# Altium project OpenRing-V1R1.PrjPcb (part 1 of 2)
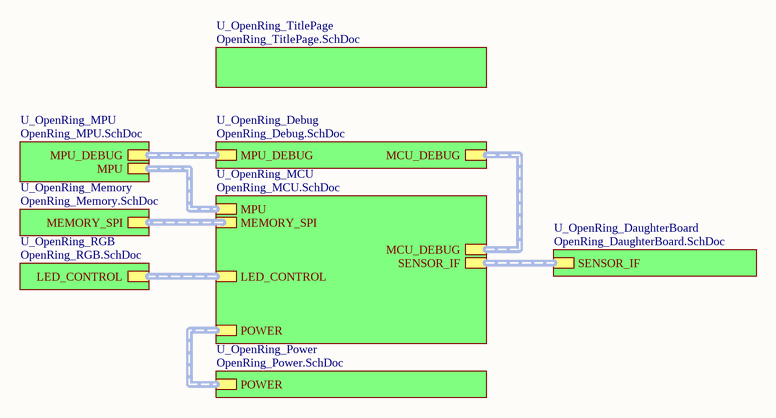
[diagram p0: OpenRing-Main.SchDoc]
ApprovedBy: Dariush Salami; BoardName: ORing-RevA; DrawnBy: Yusein Ali; Engineer: Yusein Ali; Project: OpenRing-V1R0; Revision: A0; RevisionDate: 01.05.2025
9 sheets, 73 parts. Net scope: hierarchical (ports join the sheet entries above them; power ports are global).
Board file: OpenRing-V1R1-MainBoard.PcbDoc
Sheets:
  OpenRing-Main.SchDoc
    U_OpenRing_MCU = OpenRing_MCU.SchDoc
    U_OpenRing_Debug = OpenRing_Debug.SchDoc
    U_OpenRing_MPU = OpenRing_MPU.SchDoc
    U_OpenRing_Memory = OpenRing_Memory.SchDoc
    U_OpenRing_RGB = OpenRing_RGB.SchDoc
    U_OpenRing_DaughterBoard = OpenRing_DaughterBoard.SchDoc
    U_OpenRing_Power = OpenRing_Power.SchDoc
    U_OpenRing_TitlePage = OpenRing_TitlePage.SchDoc

## Sheet OpenRing-Main.SchDoc
size A4; Size: A4; ApprovedBy: Dariush Salami; DrawnBy: Yusein Ali; Engineer: Yusein Ali; Revision: A0; SheetNumber: 1; SheetTotal: 9

### Sub-sheets
U_OpenRing_DaughterBoard = OpenRing_DaughterBoard.SchDoc: SENSOR_IF (harness SENSOR_IF)
U_OpenRing_Debug = OpenRing_Debug.SchDoc: MPU_DEBUG (harness MPU_DEBUG), MCU_DEBUG (harness MCU_DEBUG)
U_OpenRing_MCU = OpenRing_MCU.SchDoc: MEMORY_SPI (harness MEMORY_SPI), MPU (harness MPU), SENSOR_IF (harness SENSOR_IF), POWER (harness POWER), MCU_DEBUG (harness MCU_DEBUG), LED_CONTROL (harness LED_CONTROL)
U_OpenRing_Memory = OpenRing_Memory.SchDoc: MEMORY_SPI (harness MEMORY_SPI)
U_OpenRing_MPU = OpenRing_MPU.SchDoc: MPU (harness MPU), MPU_DEBUG (harness MPU_DEBUG)
U_OpenRing_Power = OpenRing_Power.SchDoc: POWER (harness POWER)
U_OpenRing_RGB = OpenRing_RGB.SchDoc: LED_CONTROL (harness LED_CONTROL)
U_OpenRing_TitlePage = OpenRing_TitlePage.SchDoc: no entries

### Buses and harness runs
harness sheet U_OpenRing_DaughterBoard/SENSOR_IF = sheet U_OpenRing_MCU/SENSOR_IF
harness sheet U_OpenRing_Debug/MCU_DEBUG = sheet U_OpenRing_MCU/MCU_DEBUG
harness sheet U_OpenRing_Debug/MPU_DEBUG = sheet U_OpenRing_MPU/MPU_DEBUG
harness sheet U_OpenRing_MCU/LED_CONTROL = sheet U_OpenRing_RGB/LED_CONTROL
harness sheet U_OpenRing_MCU/MEMORY_SPI = sheet U_OpenRing_Memory/MEMORY_SPI
harness sheet U_OpenRing_MCU/MPU = sheet U_OpenRing_MPU/MPU
harness sheet U_OpenRing_MCU/POWER = sheet U_OpenRing_Power/POWER

### Notes on the sheet
- Designer/Engineer
- Drawn By
- Document Name
- Board Title
- Sheet
- of
- Size
- A4
- Approved By
- Rev.
- Date

## Sheet OpenRing_MCU.SchDoc
size A3; Size: A4; ApprovedBy: Dariush Salami; DrawnBy: Yusein Ali; Engineer: Yusein Ali; Revision: A0; SheetNumber: 2; SheetTotal: 9
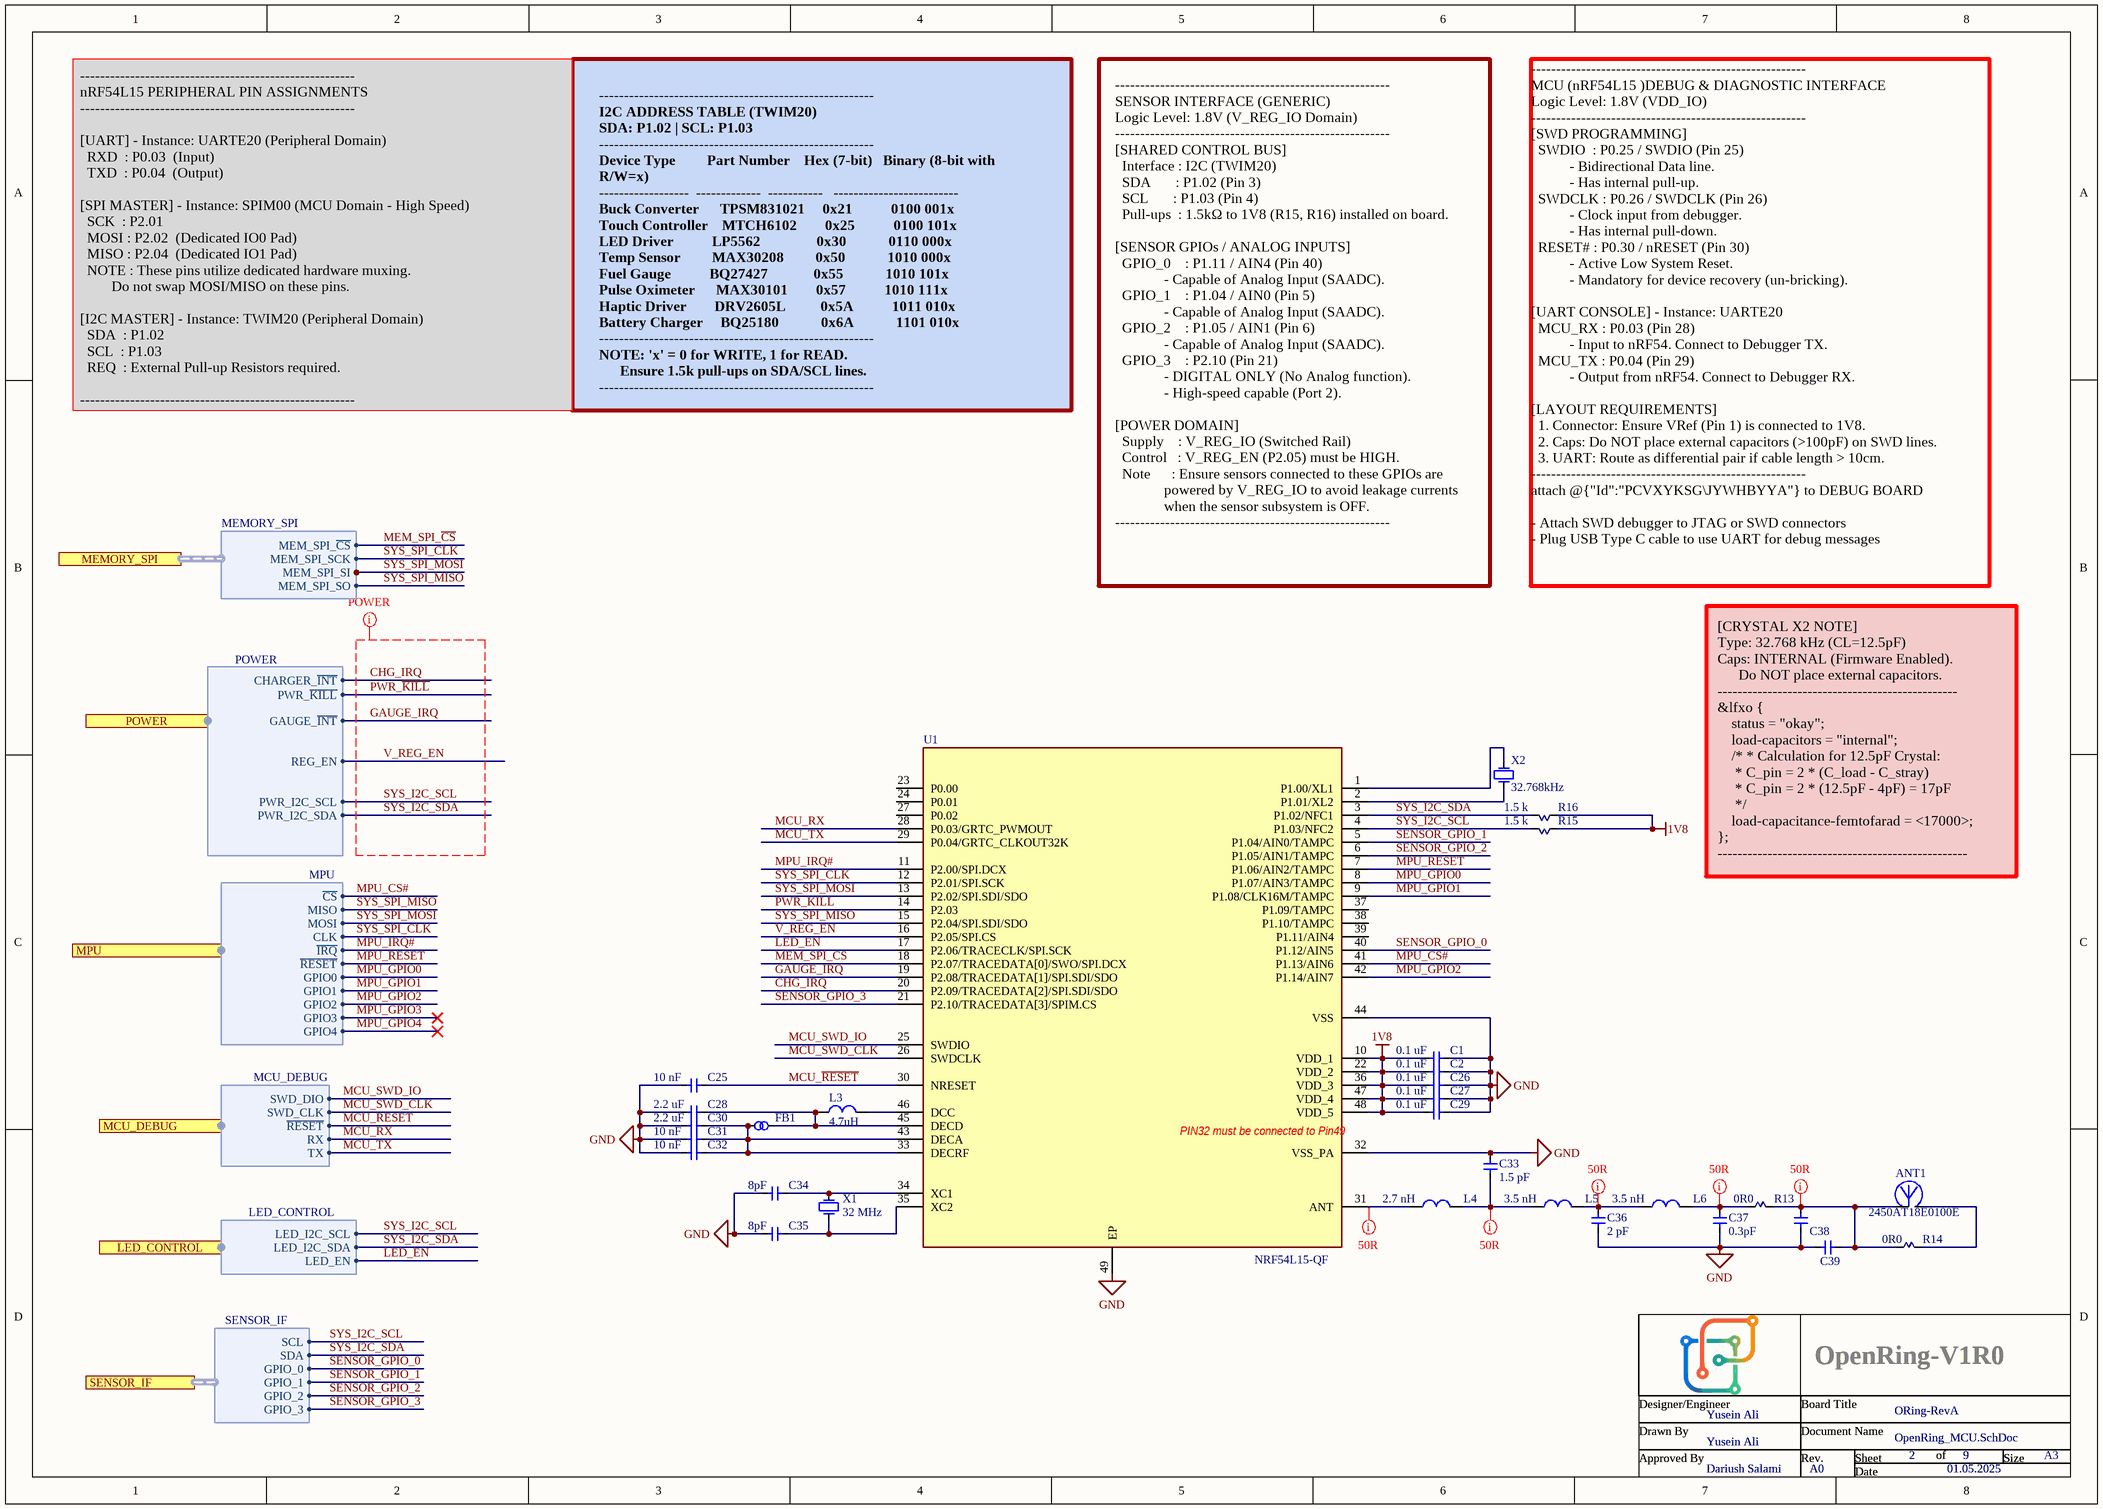
[diagram p1: OpenRing_MCU.SchDoc]

### Parts
ANT1  2450AT18E0100E  [ANTC3216X130N]
C1  0.1 uF  [CAPC1005X05N]
C2  0.1 uF  [CAPC1005X05N]
C25  10 nF  [CAPC1005X05N]
C26  0.1 uF  [CAPC1005X05N]
C27  0.1 uF  [CAPC1005X05N]
C28  2.2 uF  [CAPC1005X05N]
C29  0.1 uF  [CAPC1005X05N]
C30  2.2 uF  [CAPC1005X05N]
C31  10 nF  [CAPC1005X05N]
C32  10 nF  [CAPC1005X05N]
C33  1.5 pF  [CAPC1005X05N]
C34  8pF  [CAPC1005X05N]
C35  8pF  [CAPC1005X05N]
C36  2 pF  [CAPC1005X05N]
C37  0.3pF  [INDC1005X06N]
C38  NC  [CAPC1005X05N]  (value not drawn)
C39  NC  [CAPC1005X05N]  (value not drawn)
FB1  BLM15AG121SN1D  [INDC1005X06N]  (value not drawn)
L3  4.7uH  [INDC1005X06N]
L4  2.7 nH  [INDC1005X06N]
L5  3.5 nH  [INDC1005X06N]
L6  3.5 nH  [INDC1005X06N]
R13  0R0  [RESC1005X04N]
R14  0R0  [RESC1005X04N]
R15  1.5 k  [RESC1005X04N]
R16  1.5 k  [RESC1005X04N]
U1  NRF54L15-QF  [QFN40P600X600X95-49N]
X1  32 MHz  [FP-ABM11W-MFG]
X2  32.768kHz  [Abracon_ABS6_2012X06L]

### Ports
LED_CONTROL (harness LED_CONTROL), MCU_DEBUG (harness MCU_DEBUG), MEMORY_SPI (harness MEMORY_SPI), MPU (harness MPU), POWER (harness POWER), SENSOR_IF (harness SENSOR_IF)

### Harnesses
MEMORY_SPI: MEM_SPI_~{CS}, MEM_SPI_SI, MEM_SPI_SO, MEM_SPI_SCK
MPU: ~{CS}, MISO, MOSI, CLK, ~{IRQ}, ~{RESET}, GPIO0, GPIO1, GPIO2, GPIO3, GPIO4
POWER: CHARGER_~{INT}, PWR_I2C_SCL, PWR_~{KILL}, GAUGE_~{INT}, PWR_I2C_SDA, REG_EN
MCU_DEBUG: SWD_DIO, SWD_CLK, ~{RESET}, RX, TX
SENSOR_IF: SCL, SDA, GPIO_0, GPIO_1, GPIO_2, GPIO_3
LED_CONTROL: LED_I2C_SCL, LED_I2C_SDA, LED_EN

### Nets
1V8: C1.1 C2.1 C26.1 C27.1 C29.1 R15.1 R16.1 U1.10(VDD_1) U1.22(VDD_2) U1.36(VDD_3) U1.47(VDD_4) U1.48(VDD_5)
GND: C1.2 C2.2 C25.1 C26.2 C27.2 C28.1 C29.2 C30.1 C31.1 C32.1 C33.2 C34.1 C35.1 C36.1 C37.1 C38.1 C39.2 U1.32(VSS_PA) U1.44(VSS) U1.49(EP)
CHG_IRQ: U1.20(P2.09/TRACEDATA[2]/SPI.SDI/SDO) ; port POWER.CHARGER_~{INT}
GAUGE_IRQ: U1.19(P2.08/TRACEDATA[1]/SPI.SDI/SDO) ; port POWER.GAUGE_~{INT}
LED_EN: U1.17(P2.06/TRACECLK/SPI.SCK) ; port LED_CONTROL.LED_EN
MCU_~{RESET}: C25.2 U1.30(NRESET) ; port MCU_DEBUG.~{RESET}
MCU_RX: U1.28(P0.03/GRTC_PWMOUT) ; port MCU_DEBUG.RX
MCU_SWD_CLK: U1.26(SWDCLK) ; port MCU_DEBUG.SWD_CLK
MCU_SWD_IO: U1.25(SWDIO) ; port MCU_DEBUG.SWD_DIO
MCU_TX: U1.29(P0.04/GRTC_CLKOUT32K) ; port MCU_DEBUG.TX
MEM_SPI_~{CS}: U1.18(P2.07/TRACEDATA[0]/SWO/SPI.DCX) ; port MEMORY_SPI.MEM_SPI_~{CS}
MPU_CS#: U1.41(P1.13/AIN6) ; port MPU.~{CS}
MPU_GPIO0: U1.8(P1.07/AIN3/TAMPC) ; port MPU.GPIO0
MPU_GPIO1: U1.9(P1.08/CLK16M/TAMPC) ; port MPU.GPIO1
MPU_GPIO2: U1.42(P1.14/AIN7) ; port MPU.GPIO2
MPU_IRQ#: U1.11(P2.00/SPI.DCX) ; port MPU.~{IRQ}
MPU_~{RESET}: U1.7(P1.06/AIN2/TAMPC) ; port MPU.~{RESET}
PWR_~{KILL}: U1.14(P2.03) ; port POWER.PWR_~{KILL}
SENSOR_GPIO_0: U1.40(P1.12/AIN5) ; port SENSOR_IF.GPIO_0
SENSOR_GPIO_1: U1.5(P1.04/AIN0/TAMPC) ; port SENSOR_IF.GPIO_1
SENSOR_GPIO_2: U1.6(P1.05/AIN1/TAMPC) ; port SENSOR_IF.GPIO_2
SENSOR_GPIO_3: U1.21(P2.10/TRACEDATA[3]/SPIM.CS) ; port SENSOR_IF.GPIO_3
SYS_I2C_SCL: R15.2 U1.4(P1.03/NFC2) ; port POWER.PWR_I2C_SCL, port SENSOR_IF.SCL, port LED_CONTROL.LED_I2C_SCL  [project net PWR_I2C_SCL]
SYS_I2C_SDA: R16.2 U1.3(P1.02/NFC1) ; port POWER.PWR_I2C_SDA, port SENSOR_IF.SDA, port LED_CONTROL.LED_I2C_SDA  [project net PWR_I2C_SDA]
SYS_SPI_CLK: U1.12(P2.01/SPI.SCK) ; port MEMORY_SPI.MEM_SPI_SCK, port MPU.CLK  [project net MPU_CLK]
SYS_SPI_MISO: U1.15(P2.04/SPI.SDI/SDO) ; port MEMORY_SPI.MEM_SPI_SO, port MPU.MISO  [project net MPU_MISO]
SYS_SPI_MOSI: U1.13(P2.02/SPI.SDI/SDO) ; port MEMORY_SPI.MEM_SPI_SI, port MPU.MOSI  [project net MPU_MOSI]
V_REG_EN: U1.16(P2.05/SPI.CS) ; port POWER.REG_EN
NetANT1_1: ANT1.1 C38.2 C39.1 R13.2 R14.1
NetANT1_2: ANT1.2 R14.2
NetC28_2: C28.2 FB1.2 L3.1 U1.45(DECD)
NetC30_2: C30.2 C31.2 C32.2 FB1.1 U1.33(DECRF) U1.43(DECA)
NetC33_1: C33.1 L4.2 L5.1
NetC34_2: C34.2 U1.34(XC1) X1.3(OSC2)
NetC35_2: C35.2 U1.35(XC2) X1.1(OSC1)
NetC36_2: C36.2 L5.2 L6.1
NetC37_2: C37.2 L6.2 R13.1
NetL3_2: L3.2 U1.46(DCC)
NetL4_1: L4.1 U1.31(ANT)
NetU1_1: U1.1(P1.00/XL1) X2.2(OSC2)
NetU1_2: U1.2(P1.01/XL2) X2.1(OSC1)

Not connected (* = marked no-connect by the designer): U1 23(P0.00) 24(P0.01) 27(P0.02) 37(P1.09/TAMPC) 38(P1.10/TAMPC) 39(P1.11/AIN4)

### Layout directives
net class PWR Control: CHG_IRQ, GAUGE_IRQ, PWR_~{KILL}, SYS_I2C_SCL, SYS_I2C_SDA, V_REG_EN
Impedance: 50; rule Width Constraint [Pref Impedance = 50.00ohms    Min Impedance = 50.00ohms    Max Impedance = 50.00ohms]: NetANT1_1, NetC33_1, NetC36_2, NetC37_2, NetL4_1

### Notes on the sheet
- -------------------------------------------------------
  nRF54L15 PERIPHERAL PIN ASSIGNMENTS
  -------------------------------------------------------
  [UART] - Instance: UARTE20 (Peripheral Domain)
  RXD  : P0.03  (Input)
  TXD  : P0.04  (Output)
  [SPI MASTER] - Instance: SPIM00 (MCU Domain - High Speed)
  SCK  : P2.01
  MOSI : P2.02  (Dedicated IO0 Pad)
  MISO : P2.04  (Dedicated IO1 Pad)
  NOTE : These pins utilize dedicated hardware muxing.
  Do not swap MOSI/MISO on these pins.
  [I2C MASTER] - Instance: TWIM20 (Peripheral Domain)
  SDA  : P1.02
  SCL  : P1.03
  REQ  : External Pull-up Resistors required.
  -------------------------------------------------------
- -------------------------------------------------------
  I2C ADDRESS TABLE (TWIM20)
  SDA: P1.02 | SCL: P1.03
  -------------------------------------------------------
  Device Type         Part Number    Hex (7-bit)   Binary (8-bit with R/W=x)
  ------------------  -------------  -----------   -------------------------
  Buck Converter      TPSM831021     0x21           0100 001x
  Touch Controller    MTCH6102        0x25           0100 101x
  LED Driver           LP5562                0x30            0110 000x
  Temp Sensor         MAX30208         0x50            1010 000x
  Fuel Gauge           BQ27427             0x55            1010 101x
  Pulse Oximeter      MAX30101        0x57           1010 111x
  Haptic Driver        DRV2605L          0x5A           1011 010x
  Battery Charger     BQ25180            0x6A            1101 010x
  -------------------------------------------------------
  NOTE: 'x' = 0 for WRITE, 1 for READ.
  Ensure 1.5k pull-ups on SDA/SCL lines.
  -------------------------------------------------------
- -------------------------------------------------------
  SENSOR INTERFACE (GENERIC)
  Logic Level: 1.8V (V_REG_IO Domain)
  -------------------------------------------------------
  [SHARED CONTROL BUS]
  Interface : I2C (TWIM20)
  SDA       : P1.02 (Pin 3)
  SCL       : P1.03 (Pin 4)
  Pull-ups  : 1.5kΩ to 1V8 (R15, R16) installed on board.
  [SENSOR GPIOs / ANALOG INPUTS]
  GPIO_0    : P1.11 / AIN4 (Pin 40)
  - Capable of Analog Input (SAADC).
  GPIO_1    : P1.04 / AIN0 (Pin 5)
  - Capable of Analog Input (SAADC).
  GPIO_2    : P1.05 / AIN1 (Pin 6)
  - Capable of Analog Input (SAADC).
  GPIO_3    : P2.10 (Pin 21)
  - DIGITAL ONLY (No Analog function).
  - High-speed capable (Port 2).
  [POWER DOMAIN]
  Supply    : V_REG_IO (Switched Rail)
  Control   : V_REG_EN (P2.05) must be HIGH.
  Note      : Ensure sensors connected to these GPIOs are
  powered by V_REG_IO to avoid leakage currents
  when the sensor subsystem is OFF.
  -------------------------------------------------------
- -------------------------------------------------------
  MCU (nRF54L15 )DEBUG & DIAGNOSTIC INTERFACE
  Logic Level: 1.8V (VDD_IO)
  -------------------------------------------------------
  [SWD PROGRAMMING]
  SWDIO  : P0.25 / SWDIO (Pin 25)
  - Bidirectional Data line.
  - Has internal pull-up.
  SWDCLK : P0.26 / SWDCLK (Pin 26)
  - Clock input from debugger.
  - Has internal pull-down.
  RESET# : P0.30 / nRESET (Pin 30)
  - Active Low System Reset.
  - Mandatory for device recovery (un-bricking).
  [UART CONSOLE] - Instance: UARTE20
  MCU_RX : P0.03 (Pin 28)
  - Input to nRF54. Connect to Debugger TX.
  MCU_TX : P0.04 (Pin 29)
  - Output from nRF54. Connect to Debugger RX.
  [LAYOUT REQUIREMENTS]
  1. Connector: Ensure VRef (Pin 1) is connected to 1V8.
  2. Caps: Do NOT place external capacitors (>100pF) on SWD lines.
  3. UART: Route as differential pair if cable length > 10cm.
  -------------------------------------------------------
  attach @{"Id":"PCVXYKSG\JYWHBYYA"} to DEBUG BOARD
  - Attach SWD debugger to JTAG or SWD connectors
  - Plug USB Type C cable to use UART for debug messages
- [CRYSTAL X2 NOTE]
  Type: 32.768 kHz (CL=12.5pF)
  Caps: INTERNAL (Firmware Enabled).
  Do NOT place external capacitors.
  ------------------------------------------------
  &lfxo {
  status = "okay";
  load-capacitors = "internal";
  /* * Calculation for 12.5pF Crystal:
  * C_pin = 2 * (C_load - C_stray)
  * C_pin = 2 * (12.5pF - 4pF) = 17pF
  */
  load-capacitance-femtofarad = <17000>;
  };
  --------------------------------------------------
- (near U1) PIN32 must be connected to Pin49
- Designer/Engineer
- Drawn By
- Document Name
- Board Title
- Sheet
- of
- Size
- A3
- Approved By
- Rev.
- Date

### Library data of the parts
ANT1 = 2450AT18E0100E: 7 Inch Reel / Mini 2.45Ghz Chip Antenna; Manufacturer: Johanson; Checked: TRUE; Supplier: Mouser; Supplier Part Number: 609-2450AT18E0100E; Manufacturer Part Number: 2450AT18E0100E; RoHS: Yes; Category: RF Antennas; Stock: 4431; Pricing: 1=0.69, 10=0.624, 50=0.624, 100=0.479, 1000=0.303, 10000=0.245 (USD); ComponentLink1URL: https://datasheet.ciiva.com/24048/antenna-2450at18e0100-253355-24048542.pdf?src-supplier=Mouser; ComponentLink1Description: https://datasheet.ciiva.com/24048/antenna-2450at18e0100-253355-24048542.pdf?src-supplier=Mouser; Supplier 1: Mouser; Supplier Part Number 1: 609-2450AT18E0100E
C1 C2 C26 C27 C29 = GRM155R61C104KA88D: CAP CER 0.1UF 16V X5R 0402; Manufacturer: Murata Electronics; Tolerance: 10 %; Type: Chip Multilayer Ceramic Capacitor for General Purpose; Voltage Rating DC: 16 VDC; Capacitance - nF: 100 nF; Capacitance - pF: 100000 pF; Manufacturer Part Number: GRM155R61C104KA88D; RoHS: RoHS Compliant; Category: Multilayer Ceramic Capacitors MLCC - SMD/SMT; Stock: 0; Pricing: 1=0.082, 10=0.026, 100=0.011, 500=0.008, 1000=0.007, 2500=0.006, 5000=0.005, 10000=0.004 (EUR); Capacitance: 0.1 uF; Height: 0.5 mm; Length: 1 mm; Package / Case: 0402 (1005 metric); Packaging: Cut Tape; Product: General Type MLCCs; Series: GRM; Termination Style: SMD/SMT; Width: 0.5 mm; Brand: Murata Electronics; Case Code - in: 0402; Case Code - mm: 1005; Dielectric: X5R; Maximum Operating Temperature: + 85 C; Minimum Operating Temperature: - 55 C; Standard Pack Qty: 10000; Termination: Standard; RoHS - Mouser: Y; Minimum Order Quantity: 1; Reeling: True; ComponentLink1URL: http://www.mouser.com/datasheet/2/281/murata_03052018_GRM_Series_1-1310166.pdf; ComponentLink1Description: http://www.mouser.com/datasheet/2/281/murata_03052018_GRM_Series_1-1310166.pdf; Value: 0.1 uF; Supplier 1: Mouser; Supplier Part Number 1: 81-GRM155R61C104KA8D; Supplier 2: Digikey; Supplier Part Number 2: 490-5415-1-ND; Supplier 3: Digikey; Supplier Part Number 3: 490-5415-6-ND
C25 C31 C32 = GRM155R71H103KA88D: CAP CER 10000PF 50V X7R 0402; Manufacturer: Murata Electronics North America; Tolerance: ±10%; Supplier 1: Digi-Key; Manufacturer Part Number: GRM155R71H103KA88D; RoHS: RoHS Compliant; Category: Capacitors; Stock 1: 7217649; Pricing 1: 1=0.11, 50=0.0056, 100=0.0047, 250=0.00384, 500=0.0033, 1000=0.00256, 5000=0.00213 (GBP); Packaging: Digi-Reel®; Part Status: Active; Capacitance: 10000pF; Voltage - Rated: 50V; Temperature Coefficient: X7R; Mounting Type: Surface Mount, MLCC; Operating Temperature: -55°C ~ 125°C; Applications: General Purpose; Ratings: -; Package / Case: 0402 (1005 Metric); Size / Dimension: 0.039" L x 0.020" W (1.00mm x 0.50mm); Height - Seated (Max): -; Thickness (Max): 0.022" (0.55mm); Lead Spacing: -; Features: -; Lead Style: -; ComponentLink1URL: http://www.murata.com/~/media/webrenewal/support/library/catalog/products/capacitor/mlcc/c02e.pdf; ComponentLink1Description: http://www.murata.com/~/media/webrenewal/support/library/catalog/products/capacitor/mlcc/c02e.pdf; Supplier Part Number 1: 490-4516-6-ND; Value: 10 nF
C28 C30 = GRM155R61A225KE95D: CAP CER 2.2UF 10V X5R 0402; Manufacturer: Murata Electronics North America; Capacitance: 2.2µF; Tolerance: ±10%; Supplier 1: Digi-Key; Manufacturer Part Number: GRM155R61A225KE95D; RoHS: RoHS Compliant; Category: Capacitors; Stock 1: 370562; Pricing 1: 1=0.1, 10=0.06, 50=0.0326, 100=0.0275, 250=0.02252, 500=0.01926, 1000=0.015, 5000=0.0125 (USD); Packaging: Digi-Reel®; Part Status: Active; Voltage - Rated: 10V; Temperature Coefficient: X5R; Operating Temperature: -55°C ~ 85°C; Features: Derating Recommended; Ratings: -; Applications: General Purpose; Mounting Type: Surface Mount, MLCC; Package / Case: 0402 (1005 Metric); Size / Dimension: 0.039" L x 0.020" W (1.00mm x 0.50mm); Height - Seated (Max): -; Thickness (Max): 0.022" (0.55mm); Lead Spacing: -; Lead Style: -; ComponentLink1URL: http://www.murata.com/~/media/webrenewal/support/library/catalog/products/capacitor/mlcc/c02e.ashx; ComponentLink1Description: http://www.murata.com/~/media/webrenewal/support/library/catalog/products/capacitor/mlcc/c02e.ashx; Supplier Part Number 1: 490-10451-6-ND; Value: 2.2 uF
C33 = GJM1555C1H1R5BB01D: Multilayer Ceramic Capacitor, 1.5 pF, 50 V, ï¿½ 0.1pF, C0G (NP0), 0402 [1005 Metric]; Manufacturer: Murata; Material: 4241ConductorMaterial; Supplier: Mouser; Supplier Part Number: 81-GJM1555C1H1R5BB1D; Manufacturer Part Number: GJM1555C1H1R5BB01D; RoHS: Yes; Category: Ceramic Capacitors; Stock: 9670; Pricing: 1=0.1, 10=0.05, 50=0.05, 100=0.03, 1000=0.022, 10000=0.011 (USD); Lead Free: 5697LeadFree; ComponentLink1URL: https://datasheet.ciiva.com/8030/1700191-8030107.pdf?src-supplier=Element14; ComponentLink1Description: https://datasheet.ciiva.com/8030/1700191-8030107.pdf?src-supplier=Element14; ComponentLink2URL: https://datasheet.ciiva.com/26843/getdatasheetpartid-698463-26843693.pdf?src-supplier=Verical; ComponentLink2Description: https://datasheet.ciiva.com/26843/getdatasheetpartid-698463-26843693.pdf?src-supplier=Verical; ComponentLink3URL: https://datasheet.ciiva.com/29542/partnumbering-e-01-29542725.pdf?src-supplier=Digikey; ComponentLink3Description: https://datasheet.ciiva.com/29542/partnumbering-e-01-29542725.pdf?src-supplier=Digikey; ComponentLink4URL: https://datasheet.ciiva.com/29542/partnumbering-e-01-29542726.pdf?src-supplier=Digikey; ComponentLink4Description: https://datasheet.ciiva.com/29542/partnumbering-e-01-29542726.pdf?src-supplier=Digikey; ComponentLink5URL: https://datasheet.ciiva.com/16440/l0005e-16440473.pdf?src-supplier=Future+Electronics; ComponentLink5Description: https://datasheet.ciiva.com/16440/l0005e-16440473.pdf?src-supplier=Future+Electronics; Value: 1.5 pF; Supplier 1: Mouser; Supplier Part Number 1: 81-GJM1555C1H1R5BB1D; Supplier 2: Digikey; Supplier Part Number 2: 490-8087-1-ND; Supplier 3: Digikey; Supplier Part Number 3: 490-8087-6-ND
C34 C35 = GRM1555C1H8R0BA01D: Multilayer Ceramic Capacitors MLCC - SMD/SMT 0402 8.0pF 50volts C0G +/-0.05pF; Manufacturer: Murata; Voltage Rating: 50V; Supplier: Digi-Key; Supplier Part Number: 490-8230-1-ND; Manufacturer Part Number: GRM1555C1H8R0BA01D; RoHS: Yes; Category: Ceramic Capacitors; Stock: 671988; Pricing: 1=0,1, 10=0,051, 50=0,0278, 100=0,0227, 500=0,01624, 1000=0,01276, 2500=0,0116, 5000=0,01067 (USD); Mounting Technology: Surface Mount; Case/Package: 0402; Case Code (Metric): 1005; Case Code (Imperial): 0402; Min Operating Temperature: -55°C; Max Operating Temperature: 125°C; Value: 8pF; Package Quantity: 1; Packaging: Tape and Reel; Series: GRM; Termination: SMD/SMT; Voltage Rating (DC): 50V; Dielectric: C0G; Construction: Flat; Length: 1mm; Width: 0.02inch; Height: 0.5mm; Thickness: 0.022inch; Depth: 0.5mm; Radiation Hardening: No; RoHS Compliant: Yes; Lead Free: Lead Free; ComponentLink1URL: https://datasheet.ciiva.com/18184/getdatasheetpartid-319021-18184500.pdf?src-supplier=Verical; ComponentLink1Description: https://datasheet.ciiva.com/18184/getdatasheetpartid-319021-18184500.pdf?src-supplier=Verical; ComponentLink2URL: https://datasheet.ciiva.com/6263/grm1555c1h820ga01-01-6263780.pdf?src-supplier=Digi-Key; ComponentLink2Description: https://datasheet.ciiva.com/6263/grm1555c1h820ga01-01-6263780.pdf?src-supplier=Digi-Key; ComponentLink3URL: https://datasheet.ciiva.com/5432/product-5432205.pdf?src-supplier=Mouser; ComponentLink3Description: https://datasheet.ciiva.com/5432/product-5432205.pdf?src-supplier=Mouser; ComponentLink4URL: https://datasheet.ciiva.com/11610/product-11610151.pdf?src-supplier=Avnet; ComponentLink4Description: https://datasheet.ciiva.com/11610/product-11610151.pdf?src-supplier=Avnet; ComponentLink5URL: https://datasheet.ciiva.com/16495/c02e-16495287.pdf?src-supplier=Future+Electronics; ComponentLink5Description: https://datasheet.ciiva.com/16495/c02e-16495287.pdf?src-supplier=Future+Electronics; ComponentLink6URL: https://datasheet.ciiva.com/5442/product-5442458.pdf?src-supplier=Mouser; ComponentLink6Description: https://datasheet.ciiva.com/5442/product-5442458.pdf?src-supplier=Mouser; Supplier 1: Mouser; Supplier Part Number 1: 81-GRM1555C1H8R0BA1D; Supplier 2: Digikey; Supplier Part Number 2: 490-8230-1-ND; Supplier 3: Digikey; Supplier Part Number 3: 490-8230-6-ND
C36 = GJM1555C1H2R0WB01D: 0402 2 pF 50V ±0.05 pF Tolerance C0G SMT Multilayer Ceramic Capacitor; Manufacturer: Murata; Material: 4241ConductorMaterial; Temperature Coefficient: 30ppm/°C; Supplier: Mouser; Supplier Part Number: 81-GJM1555C1H2R0WB1D; Manufacturer Part Number: GJM1555C1H2R0WB01D; RoHS: Yes; Category: Ceramic Capacitors; Stock: 97187; Pricing: 1=0.14, 10=0.077, 50=0.077, 100=0.047, 1000=0.032, 10000=0.019 (USD); Lead Free: 5697LeadFree; ComponentLink1URL: https://datasheet.ciiva.com/26843/getdatasheetpartid-724043-26843695.pdf?src-supplier=Verical; ComponentLink1Description: https://datasheet.ciiva.com/26843/getdatasheetpartid-724043-26843695.pdf?src-supplier=Verical; Supplier 1: Mouser; Supplier Part Number 1: 81-GJM1555C1H2R0WB1D; Supplier 2: Digikey; Supplier Part Number 2: 490-11205-1-ND; Supplier 3: Digikey; Supplier Part Number 3: 490-11205-6-ND; Value: 2 pF
C37 = GJM1555C1HR30WB01D: 0402 0.3 pF 50V ±0.05 pF Tolerance C0G SMT Multilayer Ceramic Capacitor; Manufacturer: Murata; Material: 4241ConductorMaterial; Temperature Coefficient: 30ppm/°C; Supplier: Mouser; Supplier Part Number: 81-GJM1555C1HR30WB1D; Manufacturer Part Number: GJM1555C1HR30WB01D; RoHS: Yes; Category: Ceramic Capacitors; Stock: 24305; Pricing: 1=0.14, 10=0.077, 50=0.077, 100=0.047, 1000=0.031, 10000=0.021 (USD); Mounting Technology: Surface Mount; Case/Package: 0402; Case Code (Metric): 1005; Case Code (Imperial): 0402; Min Operating Temperature: -55°C; Max Operating Temperature: 125°C; Value: 0.3pF; Dielectric: C0G; Voltage Rating (DC): 50V; Packaging: Tape and Reel; Package Quantity: 10000; Termination: SMD/SMT; Series: GJM; Construction: Flat; Voltage Rating: 50V; Length: 1mm; Width: 0.02inch; Height: 0.5mm; Thickness: 0.022inch; Depth: 0.5mm; Radiation Hardening: No; RoHS Compliant: Yes; Lead Free: Lead Free; ComponentLink1URL: https://datasheet.ciiva.com/11617/product-11617574.pdf?src-supplier=Avnet; ComponentLink1Description: https://datasheet.ciiva.com/11617/product-11617574.pdf?src-supplier=Avnet; ComponentLink2URL: https://datasheet.ciiva.com/169/partnumbering-e-01-169995.pdf?src-supplier=Digikey; ComponentLink2Description: https://datasheet.ciiva.com/169/partnumbering-e-01-169995.pdf?src-supplier=Digikey; Supplier 1: Mouser; Supplier Part Number 1: 81-GJM1555C1HR30WB1D; Supplier 2: Digikey; Supplier Part Number 2: 490-11248-1-ND; Supplier 3: Digikey; Supplier Part Number 3: 490-11248-6-ND
C38 C39 = CAPACITOR
FB1 = BLM15AG121SN1D: Ferrite Beads Multi-Layer 120Ohm 25% 100MHz 550mA 190mOhm DCR 0402 Paper T/R; Manufacturer: Murata; Manufacturer Series: BLM15A; Material: Steel,Ferrite; Number of Lines: 1; ESR: 190mR; Impedance: 120R; Max DC Current: 500mA; DC Resistance-Max: 250mR; Shielding: Unshielded; Supplier: Mouser; Supplier Part Number: 81-BLM15AG121SN1D; Manufacturer Part Number: BLM15AG121SN1D; RoHS: Yes; Category: Ferrite Beads and Chips; Stock: 120691; Pricing: 1=0.1, 10=0.043, 50=0.034, 100=0.031, 1000=0.021, 10000=0.013 (USD); Case/Package: 0402; Pins: 2; Case Code (Metric): 1005; Case Code (Imperial): 0402; Core Material: Ferrite; Terminal Finish: Tin; Min Operating Temperature: -55°C; Max Operating Temperature: 125°C; Packaging: Tape and Reel; Max Current Rating: 550mA; Series: BLM15AG_SN; Tolerance: 25%; Test Frequency: 100MHz; RMS Current (Irms): 550mA; Package Quantity: 1; Termination: SMD/SMT; Number of Circuits: 1; Current Rating: 550mA; DC Resistance (DCR): 190mR; Frequency: 100MHz; DC Current: 500mA; Channels: 1; Length: 1mm; Width: 0.5mm; Height: 0.5mm; Depth: 0.55mm; Radiation Hardening: No; RoHS Compliant: Yes; Reach SVHC Compliant: No; Lead Free: Lead Free; Military Standard: Not; Supplier 1: Mouser; Supplier Part Number 1: 81-BLM15AG121SN1D; Supplier 2: Digikey; Supplier Part Number 2: 490-1005-1-ND; Supplier 3: Digikey; Supplier Part Number 3: 490-1005-6-ND
L3 = LQM18FN4R7M00D: Inductor Power Chip Shielded Multi-Layer 4.7uH 20% 1MHz Ferrite 0.08A 0.78Ohm DCR 0603 T/R; Manufacturer: Murata; Self Resonant Frequency: 50MHz; DC Resistance (DCR): 600mR; Current Rating: 80mA; Supplier: Mouser; Supplier Part Number: 81-LQM18FN4R7M00D; Manufacturer Part Number: LQM18FN4R7M00D; RoHS: Yes; Category: Fixed Inductors; Stock: 677; Pricing: 1=0.13, 10=0.11, 50=0.11, 100=0.091, 1000=0.075, 10000=0.06 (USD); Mounting Technology: Surface Mount; Case/Package: 0603; Core Material: Ferrite; Case Code (Metric): 1608; Case Code (Imperial): 0603; Weight: 7.1E-05oz; Min Operating Temperature: -55°C; Max Operating Temperature: 125°C; Tolerance: 20%; Shielding: Shielded; Packaging: Tape and Reel; Value: 4.7uH; Test Frequency: 1MHz; Series: LQM18F; Package Quantity: 1; Saturation Current: 80mA; Max DC Current: 80mA; Termination: SMD/SMT; DC Current: 80mA; Max Current Rating: 80mA; Length: 1.6mm; Width: 0.031inch; Height: 0.8mm; Height - Seated (Max): 0.035inch; Depth: 0.9mm; RoHS Compliant: Yes; Military Standard: Not; Lead Free: Lead Free; ComponentLink1URL: https://datasheet.ciiva.com/30489/0900766b812560c4-30489024.pdf?src-supplier=Rs; ComponentLink1Description: https://datasheet.ciiva.com/30489/0900766b812560c4-30489024.pdf?src-supplier=Rs; ComponentLink2URL: https://datasheet.ciiva.com/1039/l0075s0097lqm18f-1039394.pdf?src-supplier=Digikey; ComponentLink2Description: https://datasheet.ciiva.com/1039/l0075s0097lqm18f-1039394.pdf?src-supplier=Digikey; ComponentLink3URL: https://datasheet.ciiva.com/1039/l0075s0097lqm18f-1039393.pdf?src-supplier=Digikey; ComponentLink3Description: https://datasheet.ciiva.com/1039/l0075s0097lqm18f-1039393.pdf?src-supplier=Digikey; ComponentLink4URL: https://datasheet.ciiva.com/1039/l0075s0097lqm18f-1039395.pdf?src-supplier=Digikey; ComponentLink4Description: https://datasheet.ciiva.com/1039/l0075s0097lqm18f-1039395.pdf?src-supplier=Digikey; ComponentLink5URL: https://datasheet.ciiva.com/3082/l0075s0097lqm18f-3082197.pdf?src-supplier=Avnet; ComponentLink5Description: https://datasheet.ciiva.com/3082/l0075s0097lqm18f-3082197.pdf?src-supplier=Avnet; ComponentLink6URL: https://datasheet.ciiva.com/16390/l0075s0097lqm18f-16390346.pdf?src-supplier=Future+Electronics; ComponentLink6Description: https://datasheet.ciiva.com/16390/l0075s0097lqm18f-16390346.pdf?src-supplier=Future+Electronics; Supplier 1: Mouser; Supplier Part Number 1: 81-LQM18FN4R7M00D; Supplier 2: Digikey; Supplier Part Number 2: 490-4024-1-ND; Supplier 3: Digikey; Supplier Part Number 3: 490-4024-6-ND
L4 = LQG15WH2N7B02D: Inductor Chip 2.7nH 0.1nH Tolerance 2-Pin 0402 Paper T/R; Manufacturer: Murata; Supplier: Mouser; Supplier Part Number: 81-LQG15WH2N7B02D; Manufacturer Part Number: LQG15WH2N7B02D; RoHS: Yes; Category: Fixed Inductors; Stock: 6000; Pricing: 1=0.2, 10=0.161, 50=0.141, 100=0.133, 1000=0.109, 10000=0.088 (USD); Value: 2.7 nH; Supplier 1: Mouser; Supplier Part Number 1: 81-LQG15WH2N7B02D; Supplier 2: Digikey; Supplier Part Number 2: 490-LQG15WH2N7B02DDKR-ND; Supplier 3: Digikey; Supplier Part Number 3: 490-LQG15WH2N7B02DCT-ND
L5 L6 = LQG15WH3N5B02D: Inductor Chip 3.5nH 0.1nH Tolerance 2-Pin 0402 Paper T/R; Manufacturer: Murata; Supplier: Mouser; Supplier Part Number: 81-LQG15WH3N5B02D; Manufacturer Part Number: LQG15WH3N5B02D; RoHS: Yes; Category: Fixed Inductors; Stock: 9594; Pricing: 1=0.24, 10=0.187, 50=0.187, 100=0.146, 1000=0.113, 10000=0.09 (USD); Supplier 1: Mouser; Supplier Part Number 1: 81-LQG15WH3N5B02D; Supplier 2: Farnell; Supplier Part Number 2: 3639288; Supplier 3: Farnell; Supplier Part Number 3: 3639288RL; Value: 3.5 nH
R13 R14 = ERJ-2GE0R00X: RES SMD 0.0OHM JUMPER 1/10W 0402; Manufacturer: Panasonic Electronic Components; Resistance (Ohms): 0.0; Power (Watts): 0.1W, 1/10W; Supplier 1: Digi-Key; Manufacturer Part Number: ERJ-2GE0R00X; RoHS: RoHS Compliant; Category: Resistors; Stock 1: 6022701; Pricing 1: 1=0.07, 50=0.0104, 100=0.0078, 250=0.00584, 500=0.0043, 1000=0.00287, 5000=0.00202 (GBP); Packaging: Digi-Reel®; Part Status: Active; Tolerance: Jumper; Composition: Thick Film; Features: Automotive AEC-Q200; Temperature Coefficient: -; Operating Temperature: -55°C ~ 155°C; Package / Case: 0402 (1005 Metric); Supplier Device Package: 0402; Size / Dimension: 0.039" L x 0.020" W (1.00mm x 0.50mm); Height: 0.016" (0.40mm); Number of Terminations: 2; ComponentLink1URL: http://industrial.panasonic.com/www-cgi/jvcr13pz.cgi?E+PZ+3+AOA0001+ERJ2GE0R00X+7+WW; ComponentLink1Description: http://industrial.panasonic.com/www-cgi/jvcr13pz.cgi?E+PZ+3+AOA0001+ERJ2GE0R00X+7+WW; Supplier Part Number 1: P0.0JDKR-ND; Value: 0R0
R15 R16 = ERJ-2RKF1501X: RES SMD 1.5K OHM 1% 1/10W 0402; Manufacturer: Panasonic Electronic Components; Power (Watts): 0.1W, 1/10W; Temperature Coefficient: ±100ppm/°C; Supplier 1: Digi-Key; Manufacturer Part Number: ERJ-2RKF1501X; RoHS: RoHS Compliant; Category: Resistors; Stock 1: 1349197; Pricing 1: 1=0.1, 10=0.025, 25=0.018, 50=0.0136, 100=0.01, 250=0.00764, 500=0.00612, 1000=0.00451, 5000=0.00323 (USD); Packaging: Digi-Reel®; Part Status: Active; Resistance (Ohms): 1.5k; Tolerance: ±1%; Composition: Thick Film; Features: Automotive AEC-Q200; Operating Temperature: -55°C ~ 155°C; Package / Case: 0402 (1005 Metric); Supplier Device Package: 0402; Size / Dimension: 0.039" L x 0.020" W (1.00mm x 0.50mm); Height - Seated (Max): 0.016" (0.40mm); Number of Terminations: 2; Failure Rate: -; ComponentLink1URL: https://industrial.panasonic.com/cdbs/www-data/pdf/RDA0000/AOA0000C283.pdf; ComponentLink1Description: https://industrial.panasonic.com/cdbs/www-data/pdf/RDA0000/AOA0000C283.pdf; Supplier Part Number 1: P1.50KLDKR-ND; Value: 1.5 k
U1 = NRF54L15-QFAA-R: nRF54L15 SoC with Arm Cortex-M33 processor; Manufacturer: Nordic Semiconductor; Supplier: Mouser; Supplier Part Number: 949-NRF54L15-QFAA-R; Manufacturer Part Number: NRF54L15-QFAA-R; RoHS: No; Category: RF Receivers, Transceivers; Stock: 719; Pricing: 1=6.84, 10=6.11, 50=6.11, 100=5.02, 1000=3.62, 10000=3.07 (USD)
X1 = ABM11W-32.0000MHZ-8-B1U-T3: CRYSTAL 32.0000MHZ 8PF SMD, 2x1.6mm, RoHS; Manufacturer: Abracon; Checked: TRUE; Manufacturer Part Number: ABM11W-32.0000MHZ-8-B1U-T3; RoHS: Yes; Category: Crystals; Frequency: 32 MHz; ComponentLink1URL: https://abracon.com/Resonators/ABM11W.pdf?src-supplier=Digikey; ComponentLink1Description: https://abracon.com/Resonators/ABM11W.pdf?src-supplier=Digikey; Supplier 1: Mouser; Supplier Part Number 1: 815-11W32-8B1UT; Supplier 2: Digikey; Supplier Part Number 2: 535-13899-1-ND; Supplier 3: Digikey; Supplier Part Number 3: 535-13899-6-ND; Supplier 4: Digikey; Supplier Part Number 4: 535-13899-2-ND; Supplier: Digikey; Supplier Part Number: 535-13899-1-ND; Stock: 52771; Pricing: 1=0.82, 10=0.709, 50=0.6394, 100=0.6115, 500=0.5517, 1000=0.52788 (USD); ComponentLink2URL: https://datasheet.octopart.com/ABM11W-32.0000MHZ-8-B1U-T3-Abracon-datasheet-112015802.pdf?src-supplier=Master+Electronics; ComponentLink2Description: https://datasheet.octopart.com/ABM11W-32.0000MHZ-8-B1U-T3-Abracon-datasheet-112015802.pdf?src-supplier=Master+Electronics
X2 = ABS06-32.768KHZ-1-T: CRYSTAL 32.768 KHZ 12.5 PF SMD; Manufacturer: Abracon Corporation; Frequency Tolerance: ±10ppm; Load Capacitance: 12.5pF; ESR (Equivalent Series Resistance): 90 kOhm; Operating Mode: Fundamental; Supplier 1: Digi-Key; Manufacturer Part Number: ABS06-32.768KHZ-1-T; RoHS: RoHS Compliant; Category: Crystals and Oscillators; Stock 1: 6467; Pricing 1: 1=2.25, 10=1.952, 50=1.711, 100=1.3508, 500=1.14066, 750=0.99659, 1000=0.90053 (EUR); Packaging: Digi-Reel®; Type: kHz Crystal (Tuning Fork); Frequency: 32.768kHz; Frequency Stability: -; Operating Temperature: -40°C ~ 85°C; Ratings: -; Mounting Type: Surface Mount; Package / Case: 2-SMD; Size / Dimension: 0.079" L x 0.047" W (2.00mm x 1.20mm); Height: 0.024" (0.60mm); ComponentLink1URL: http://www.abracon.com/Resonators/ABS06.pdf; ComponentLink1Description: http://www.abracon.com/Resonators/ABS06.pdf; Supplier Part Number 1: 535-10248-6-ND

## Sheet OpenRing_Debug.SchDoc
size A4; Size: A4; ApprovedBy: Dariush Salami; DrawnBy: Yusein Ali; Engineer: Yusein Ali; Revision: A0; SheetNumber: 7; SheetTotal: 9
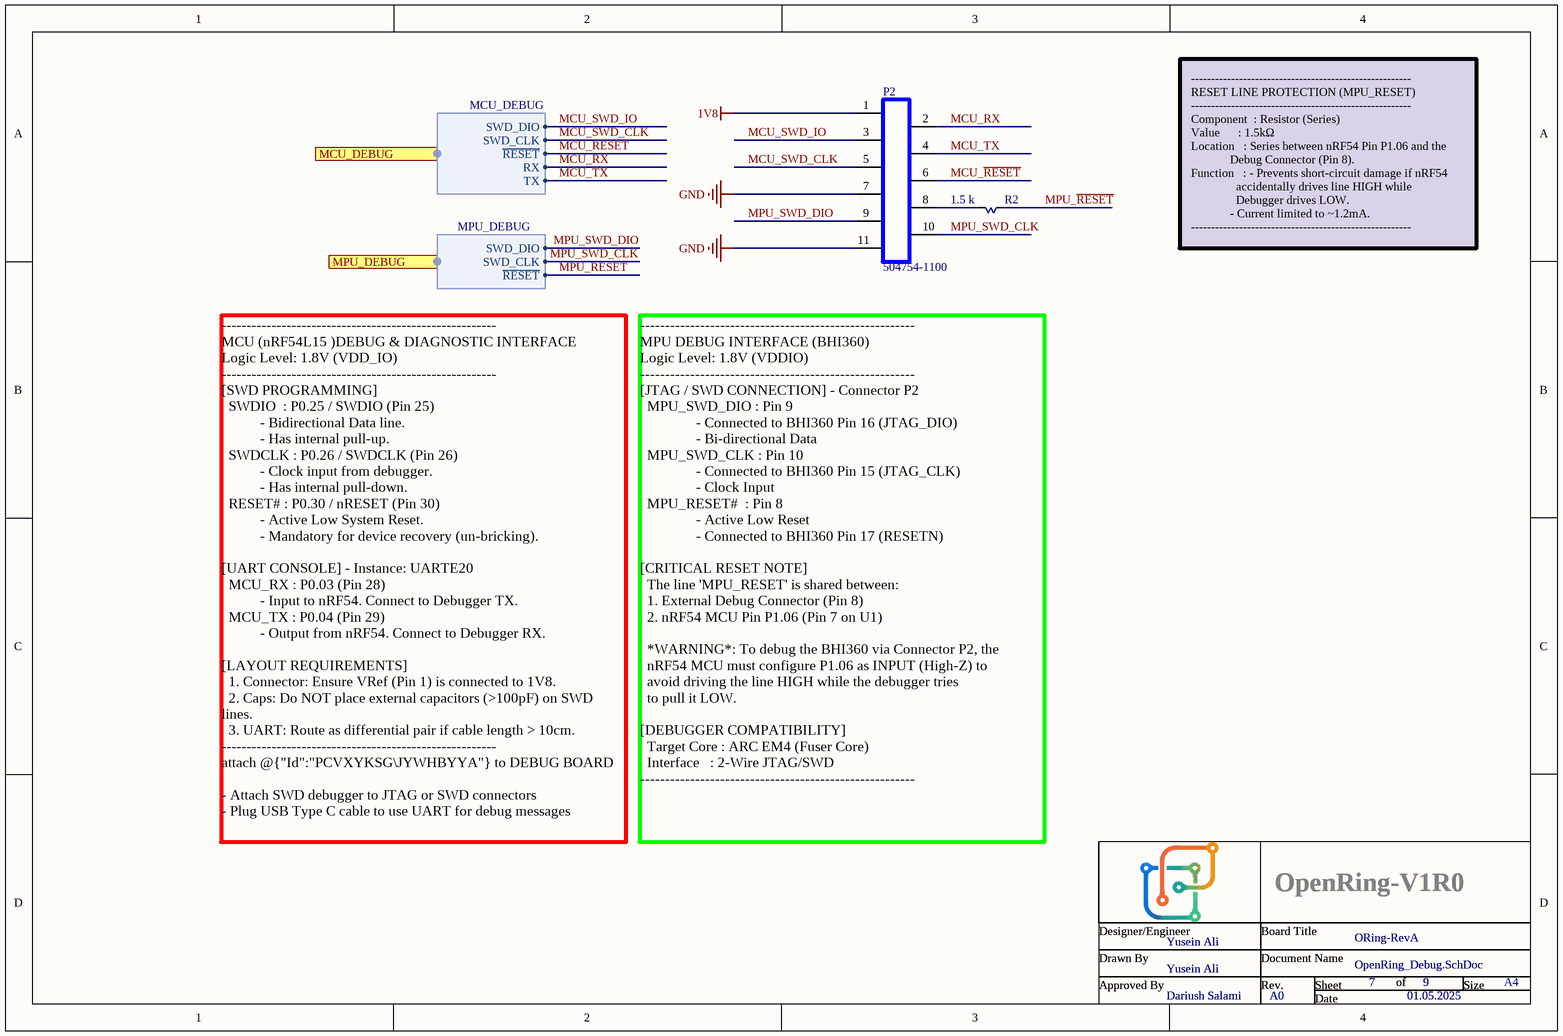
[diagram p2: OpenRing_Debug.SchDoc]

### Parts
P2  504754-1100  [5047541100]
R2  1.5 k  [RESC1005X04N]

### Ports
MCU_DEBUG (harness MCU_DEBUG), MPU_DEBUG (harness MPU_DEBUG)

### Harnesses
MPU_DEBUG: SWD_DIO, SWD_CLK, ~{RESET}
MCU_DEBUG: SWD_DIO, SWD_CLK, ~{RESET}, RX, TX

### Nets
1V8: P2.1
GND: P2.7 P2.11
MCU_~{RESET}: P2.6 ; port MCU_DEBUG.~{RESET}
MCU_RX: P2.2 ; port MCU_DEBUG.RX
MCU_SWD_CLK: P2.5 ; port MCU_DEBUG.SWD_CLK
MCU_SWD_IO: P2.3 ; port MCU_DEBUG.SWD_DIO
MCU_TX: P2.4 ; port MCU_DEBUG.TX
MPU_~{RESET}: R2.1 ; port MPU_DEBUG.~{RESET}
MPU_SWD_CLK: P2.10 ; port MPU_DEBUG.SWD_CLK
MPU_SWD_DIO: P2.9 ; port MPU_DEBUG.SWD_DIO
NetP2_8: P2.8 R2.2

### Notes on the sheet
- -------------------------------------------------------
  RESET LINE PROTECTION (MPU_RESET)
  -------------------------------------------------------
  Component  : Resistor (Series)
  Value      : 1.5kΩ
  Location   : Series between nRF54 Pin P1.06 and the
  Debug Connector (Pin 8).
  Function   : - Prevents short-circuit damage if nRF54
  accidentally drives line HIGH while
  Debugger drives LOW.
  - Current limited to ~1.2mA.
  -------------------------------------------------------
- -------------------------------------------------------
  MCU (nRF54L15 )DEBUG & DIAGNOSTIC INTERFACE
  Logic Level: 1.8V (VDD_IO)
  -------------------------------------------------------
  [SWD PROGRAMMING]
  SWDIO  : P0.25 / SWDIO (Pin 25)
  - Bidirectional Data line.
  - Has internal pull-up.
  SWDCLK : P0.26 / SWDCLK (Pin 26)
  - Clock input from debugger.
  - Has internal pull-down.
  RESET# : P0.30 / nRESET (Pin 30)
  - Active Low System Reset.
  - Mandatory for device recovery (un-bricking).
  [UART CONSOLE] - Instance: UARTE20
  MCU_RX : P0.03 (Pin 28)
  - Input to nRF54. Connect to Debugger TX.
  MCU_TX : P0.04 (Pin 29)
  - Output from nRF54. Connect to Debugger RX.
  [LAYOUT REQUIREMENTS]
  1. Connector: Ensure VRef (Pin 1) is connected to 1V8.
  2. Caps: Do NOT place external capacitors (>100pF) on SWD lines.
  3. UART: Route as differential pair if cable length > 10cm.
  -------------------------------------------------------
  attach @{"Id":"PCVXYKSG\JYWHBYYA"} to DEBUG BOARD
  - Attach SWD debugger to JTAG or SWD connectors
  - Plug USB Type C cable to use UART for debug messages
- -------------------------------------------------------
  MPU DEBUG INTERFACE (BHI360)
  Logic Level: 1.8V (VDDIO)
  -------------------------------------------------------
  [JTAG / SWD CONNECTION] - Connector P2
  MPU_SWD_DIO : Pin 9
  - Connected to BHI360 Pin 16 (JTAG_DIO)
  - Bi-directional Data
  MPU_SWD_CLK : Pin 10
  - Connected to BHI360 Pin 15 (JTAG_CLK)
  - Clock Input
  MPU_RESET#  : Pin 8
  - Active Low Reset
  - Connected to BHI360 Pin 17 (RESETN)
  [CRITICAL RESET NOTE]
  The line 'MPU_RESET' is shared between:
  1. External Debug Connector (Pin 8)
  2. nRF54 MCU Pin P1.06 (Pin 7 on U1)
  *WARNING*: To debug the BHI360 via Connector P2, the
  nRF54 MCU must configure P1.06 as INPUT (High-Z) to
  avoid driving the line HIGH while the debugger tries
  to pull it LOW.
  [DEBUGGER COMPATIBILITY]
  Target Core : ARC EM4 (Fuser Core)
  Interface   : 2-Wire JTAG/SWD
  -------------------------------------------------------
- Designer/Engineer
- Drawn By
- Document Name
- Board Title
- Sheet
- of
- Size
- A4
- Approved By
- Rev.
- Date

### Library data of the parts
P2 = 504754-1100: Conn FFC/FPC Connector SKT 11 POS 0.3mm Solder RA SMD Easy-On™ T/R; Manufacturer: Molex; CHECKED: FALSE; Supplier: Mouser; Supplier Part Number: 538-504754-1100; Manufacturer Part Number: 504754-1100; RoHS: No; Stock: 6459; Pricing: 1=0.77, 10=0.628, 50=0.544, 100=0.512, 1000=0.426, 10000=0.355 (USD); ComponentLink1URL: https://datasheet.octopart.com/504754-1100-Molex-datasheet-169278456.pdf?src-supplier=Farnell; ComponentLink1Description: https://datasheet.octopart.com/504754-1100-Molex-datasheet-169278456.pdf?src-supplier=Farnell; ComponentLink2URL: http://datasheet.octopart.com/5047541100-Molex-datasheet-38188796.pdf?src-supplier=Onlinecomponents.com; ComponentLink2Description: http://datasheet.octopart.com/5047541100-Molex-datasheet-38188796.pdf?src-supplier=Onlinecomponents.com; ComponentLink3URL: http://datasheet.octopart.com/5047541100-Molex-datasheet-38188796.pdf?src-supplier=Verical; ComponentLink3Description: http://datasheet.octopart.com/5047541100-Molex-datasheet-38188796.pdf?src-supplier=Verical; ComponentLink4URL: http://datasheet.octopart.com/5047541100-Molex-datasheet-38188796.pdf?src-supplier=Avnet; ComponentLink4Description: http://datasheet.octopart.com/5047541100-Molex-datasheet-38188796.pdf?src-supplier=Avnet; ComponentLink5URL: http://datasheet.octopart.com/5047541100-Molex-datasheet-38188796.pdf?src-supplier=TTI; ComponentLink5Description: http://datasheet.octopart.com/5047541100-Molex-datasheet-38188796.pdf?src-supplier=TTI; ComponentLink6URL: http://datasheet.octopart.com/5047541100-Molex-datasheet-38188796.pdf?src-supplier=Electro+Sonic; ComponentLink6Description: http://datasheet.octopart.com/5047541100-Molex-datasheet-38188796.pdf?src-supplier=Electro+Sonic; ComponentLink7URL: https://datasheet.octopart.com/504754-1100-Molex-datasheet-154754160.pdf?src-supplier=Master+Electronics; ComponentLink7Description: https://datasheet.octopart.com/504754-1100-Molex-datasheet-154754160.pdf?src-supplier=Master+Electronics; Supplier 1: Mouser; Supplier Part Number 1: 538-504754-1100
R2 = ERJ-2RKF1501X: as R15 on sheet OpenRing_MCU; Supplier 1: Digi-Key; Manufacturer Part Number: ERJ-2RKF1501X; RoHS: RoHS Compliant; Category: Resistors; Stock 1: 1349197; Pricing 1: 1=0.1, 10=0.025, 25=0.018, 50=0.0136, 100=0.01, 250=0.00764, 500=0.00612, 1000=0.00451, 5000=0.00323 (USD); Packaging: Digi-Reel®; Part Status: Active; Resistance (Ohms): 1.5k; Tolerance: ±1%; Composition: Thick Film; Features: Automotive AEC-Q200; Operating Temperature: -55°C ~ 155°C; Package / Case: 0402 (1005 Metric); Supplier Device Package: 0402; Size / Dimension: 0.039" L x 0.020" W (1.00mm x 0.50mm); Height - Seated (Max): 0.016" (0.40mm); Number of Terminations: 2; Failure Rate: -; ComponentLink1URL: https://industrial.panasonic.com/cdbs/www-data/pdf/RDA0000/AOA0000C283.pdf; ComponentLink1Description: https://industrial.panasonic.com/cdbs/www-data/pdf/RDA0000/AOA0000C283.pdf; Supplier Part Number 1: P1.50KLDKR-ND; Value: 1.5 k

## Sheet OpenRing_MPU.SchDoc
size A4; Size: A4; ApprovedBy: Dariush Salami; DrawnBy: Yusein Ali; Engineer: Yusein Ali; Revision: A0; SheetNumber: 5; SheetTotal: 9
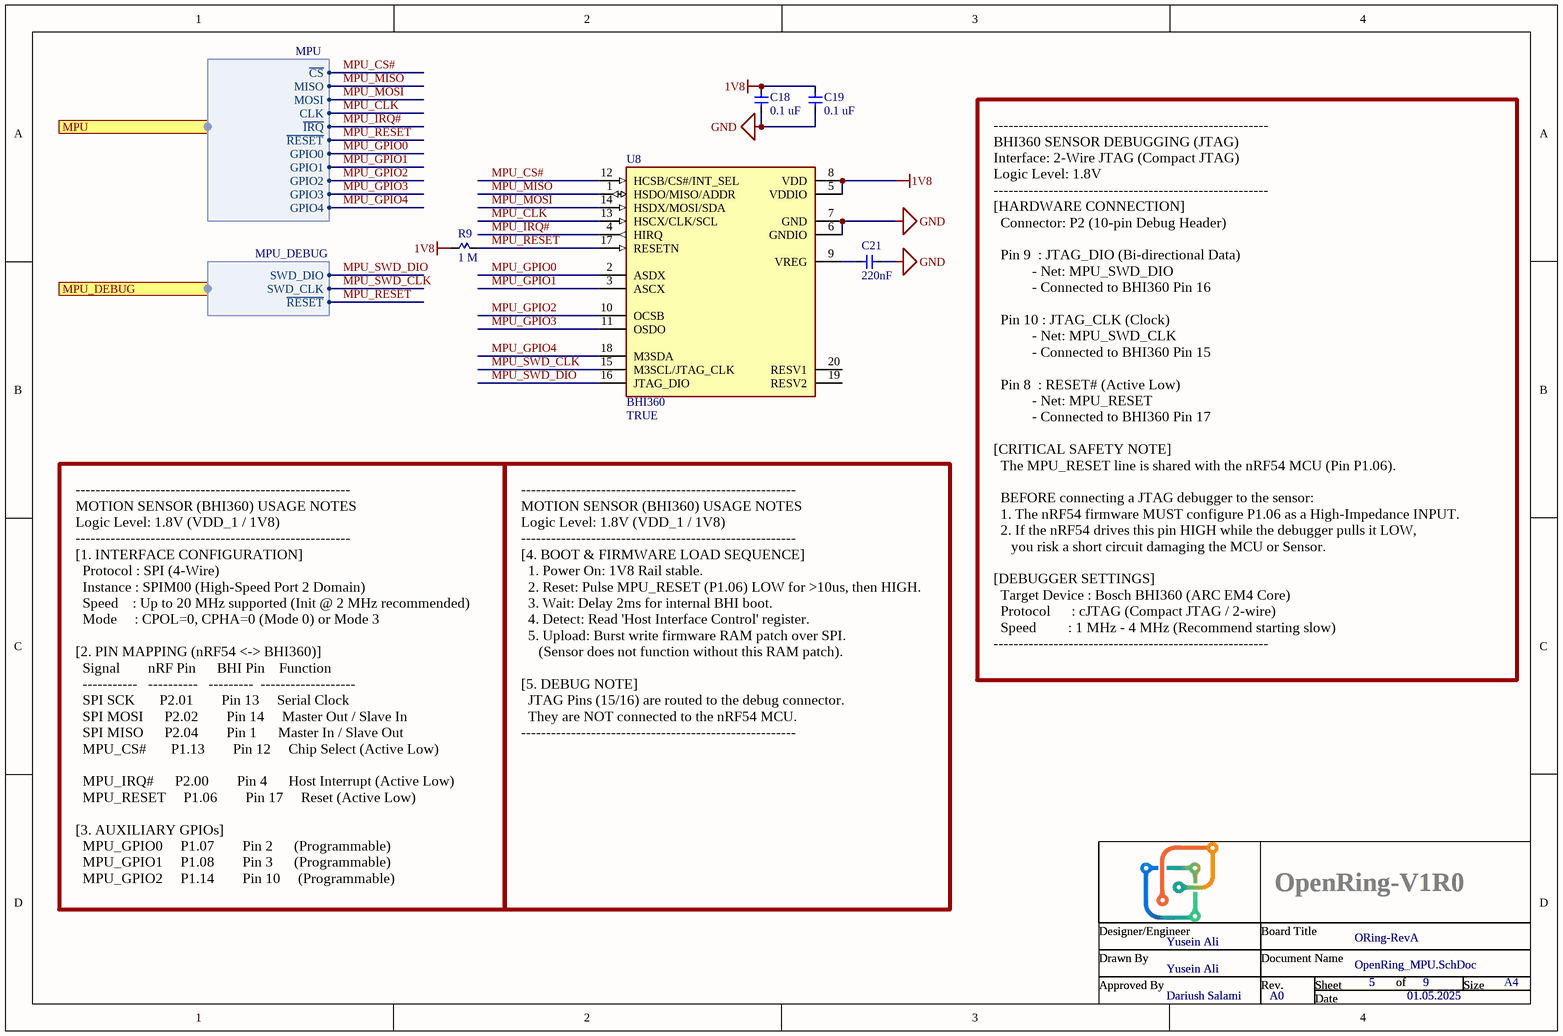
[diagram p3: OpenRing_MPU.SchDoc]

### Parts
C18  0.1 uF  [CAPC1005X05N]
C19  0.1 uF  [CAPC1005X05N]
C21  220nF  [CAPC1005X05N]
R9  1 M  [RESC1005X04N]
U8  BHI360  Checked: TRUE  [BHI360]

### Ports
MPU (harness MPU), MPU_DEBUG (harness MPU_DEBUG)

### Harnesses
MPU: ~{CS}, MISO, MOSI, CLK, ~{IRQ}, ~{RESET}, GPIO0, GPIO1, GPIO2, GPIO3, GPIO4
MPU_DEBUG: SWD_DIO, SWD_CLK, ~{RESET}

### Nets
1V8: C18.2 C19.2 R9.1 U8.5(VDDIO) U8.8(VDD)
GND: C18.1 C19.1 C21.2 U8.6(GNDIO) U8.7(GND)
MPU_CLK: U8.13(HSCX/CLK/SCL) ; port MPU.CLK
MPU_CS#: U8.12(HCSB/CS#/INT_SEL) ; port MPU.~{CS}
MPU_GPIO0: U8.2(ASDX) ; port MPU.GPIO0
MPU_GPIO1: U8.3(ASCX) ; port MPU.GPIO1
MPU_GPIO2: U8.10(OCSB) ; port MPU.GPIO2
MPU_GPIO3: U8.11(OSDO) ; port MPU.GPIO3
MPU_GPIO4: U8.18(M3SDA) ; port MPU.GPIO4
MPU_IRQ#: U8.4(HIRQ) ; port MPU.~{IRQ}
MPU_MISO: U8.1(HSDO/MISO/ADDR) ; port MPU.MISO
MPU_MOSI: U8.14(HSDX/MOSI/SDA) ; port MPU.MOSI
MPU_~{RESET}: R9.2 U8.17(RESETN) ; port MPU.~{RESET}, port MPU_DEBUG.~{RESET}
MPU_SWD_CLK: U8.15(M3SCL/JTAG_CLK) ; port MPU_DEBUG.SWD_CLK
MPU_SWD_DIO: U8.16(JTAG_DIO) ; port MPU_DEBUG.SWD_DIO
NetC21_1: C21.1 U8.9(VREG)

Not connected (* = marked no-connect by the designer): U8 19(RESV2) 20(RESV1)

### Notes on the sheet
- -------------------------------------------------------
  BHI360 SENSOR DEBUGGING (JTAG)
  Interface: 2-Wire JTAG (Compact JTAG)
  Logic Level: 1.8V
  -------------------------------------------------------
  [HARDWARE CONNECTION]
  Connector: P2 (10-pin Debug Header)
  Pin 9  : JTAG_DIO (Bi-directional Data)
  - Net: MPU_SWD_DIO
  - Connected to BHI360 Pin 16
  Pin 10 : JTAG_CLK (Clock)
  - Net: MPU_SWD_CLK
  - Connected to BHI360 Pin 15
  Pin 8  : RESET# (Active Low)
  - Net: MPU_RESET
  - Connected to BHI360 Pin 17
  [CRITICAL SAFETY NOTE]
  The MPU_RESET line is shared with the nRF54 MCU (Pin P1.06).
  BEFORE connecting a JTAG debugger to the sensor:
  1. The nRF54 firmware MUST configure P1.06 as a High-Impedance INPUT.
  2. If the nRF54 drives this pin HIGH while the debugger pulls it LOW,
  you risk a short circuit damaging the MCU or Sensor.
  [DEBUGGER SETTINGS]
  Target Device : Bosch BHI360 (ARC EM4 Core)
  Protocol      : cJTAG (Compact JTAG / 2-wire)
  Speed         : 1 MHz - 4 MHz (Recommend starting slow)
  -------------------------------------------------------
- -------------------------------------------------------
  MOTION SENSOR (BHI360) USAGE NOTES
  Logic Level: 1.8V (VDD_1 / 1V8)
  -------------------------------------------------------
  [1. INTERFACE CONFIGURATION]
  Protocol : SPI (4-Wire)
  Instance : SPIM00 (High-Speed Port 2 Domain)
  Speed    : Up to 20 MHz supported (Init @ 2 MHz recommended)
  Mode     : CPOL=0, CPHA=0 (Mode 0) or Mode 3
  [2. PIN MAPPING (nRF54 <-> BHI360)]
  Signal        nRF Pin      BHI Pin    Function
  -----------   ----------   ---------  -------------------
  SPI SCK       P2.01        Pin 13     Serial Clock
  SPI MOSI      P2.02        Pin 14     Master Out / Slave In
  SPI MISO      P2.04        Pin 1      Master In / Slave Out
  MPU_CS#       P1.13        Pin 12     Chip Select (Active Low)
  MPU_IRQ#      P2.00        Pin 4      Host Interrupt (Active Low)
  MPU_RESET     P1.06        Pin 17     Reset (Active Low)
  [3. AUXILIARY GPIOs]
  MPU_GPIO0     P1.07        Pin 2      (Programmable)
  MPU_GPIO1     P1.08        Pin 3      (Programmable)
  MPU_GPIO2     P1.14        Pin 10     (Programmable)
- -------------------------------------------------------
  MOTION SENSOR (BHI360) USAGE NOTES
  Logic Level: 1.8V (VDD_1 / 1V8)
  -------------------------------------------------------
  [4. BOOT & FIRMWARE LOAD SEQUENCE]
  1. Power On: 1V8 Rail stable.
  2. Reset: Pulse MPU_RESET (P1.06) LOW for >10us, then HIGH.
  3. Wait: Delay 2ms for internal BHI boot.
  4. Detect: Read 'Host Interface Control' register.
  5. Upload: Burst write firmware RAM patch over SPI.
  (Sensor does not function without this RAM patch).
  [5. DEBUG NOTE]
  JTAG Pins (15/16) are routed to the debug connector.
  They are NOT connected to the nRF54 MCU.
  -------------------------------------------------------
- Designer/Engineer
- Drawn By
- Document Name
- Board Title
- Sheet
- of
- Size
- A4
- Approved By
- Rev.
- Date

### Library data of the parts
C18 C19 = GRM155R61C104KA88D: as C1 on sheet OpenRing_MCU; Manufacturer Part Number: GRM155R61C104KA88D; RoHS: RoHS Compliant; Category: Multilayer Ceramic Capacitors MLCC - SMD/SMT; Stock: 0; Pricing: 1=0.082, 10=0.026, 100=0.011, 500=0.008, 1000=0.007, 2500=0.006, 5000=0.005, 10000=0.004 (EUR); Capacitance: 0.1 uF; Height: 0.5 mm; Length: 1 mm; Package / Case: 0402 (1005 metric); Packaging: Cut Tape; Product: General Type MLCCs; Series: GRM; Termination Style: SMD/SMT; Width: 0.5 mm; Brand: Murata Electronics; Case Code - in: 0402; Case Code - mm: 1005; Dielectric: X5R; Maximum Operating Temperature: + 85 C; Minimum Operating Temperature: - 55 C; Standard Pack Qty: 10000; Termination: Standard; RoHS - Mouser: Y; Minimum Order Quantity: 1; Reeling: True; ComponentLink1URL: http://www.mouser.com/datasheet/2/281/murata_03052018_GRM_Series_1-1310166.pdf; ComponentLink1Description: http://www.mouser.com/datasheet/2/281/murata_03052018_GRM_Series_1-1310166.pdf; Value: 0.1 uF; Supplier 1: Mouser; Supplier Part Number 1: 81-GRM155R61C104KA8D; Supplier 2: Digikey; Supplier Part Number 2: 490-5415-1-ND; Supplier 3: Digikey; Supplier Part Number 3: 490-5415-6-ND
C21 = GRM155R61C224KA12D: CAP CER 0.22UF 16V X5R 0402; Manufacturer: Murata; Supplier: Mouser; Supplier Part Number: 81-GRM155R61C224KA2D; Manufacturer Part Number: GRM155R61C224KA12D; RoHS: Yes; Category: Ceramic Capacitors; Stock: 8589; Pricing: 1=0.1, 10=0.043, 50=0.043, 100=0.026, 1000=0.017, 10000=0.009 (USD); Lead Free: 5697LeadFree; ComponentLink1URL: http://www.mouser.com/ds/2/281/c02e-2905.pdf?src-supplier=Mouser; ComponentLink1Description: http://www.mouser.com/ds/2/281/c02e-2905.pdf?src-supplier=Mouser; ComponentLink2URL: https://www.murata.com/~/media/webrenewal/support/library/catalog/products/capacitor/mlcc/c02e.ashx?la=en-us&src-supplier=Digikey; ComponentLink2Description: https://www.murata.com/~/media/webrenewal/support/library/catalog/products/capacitor/mlcc/c02e.ashx?la=en-us&src-supplier=Digikey; ComponentLink3URL: http://search.murata.co.jp/Ceramy/image/img/A01X/G101/ENG/GRM155R61C224KA12-01.pdf?src-supplier=Digikey; ComponentLink3Description: http://search.murata.co.jp/Ceramy/image/img/A01X/G101/ENG/GRM155R61C224KA12-01.pdf?src-supplier=Digikey; ComponentLink4URL: http://search.murata.co.jp/Ceramy/image/img/A01X/partnumbering_e_01.pdf?src-supplier=Digikey; ComponentLink4Description: http://search.murata.co.jp/Ceramy/image/img/A01X/partnumbering_e_01.pdf?src-supplier=Digikey; ComponentLink5URL: https://datasheet.octopart.com/GRM155R61C224KA12D-Murata-datasheet-22122223.pdf?src-supplier=Future+Electronics; ComponentLink5Description: https://datasheet.octopart.com/GRM155R61C224KA12D-Murata-datasheet-22122223.pdf?src-supplier=Future+Electronics; Value: 220nF; Supplier 1: Mouser; Supplier Part Number 1: 81-GRM155R61C224KA2D; Supplier 2: Digikey; Supplier Part Number 2: 490-11416-1-ND
R9 = ERJ-2RKF1004X: RES SMD 1M OHM 1% 1/10W 0402; Manufacturer: Panasonic Electronic Components; Power (Watts): 0.1W, 1/10W; Temperature Coefficient: ±100ppm/°C; Supplier 1: Digi-Key; Manufacturer Part Number: ERJ-2RKF1004X; RoHS: RoHS Compliant; Category: Resistors; Stock 1: 1590446; Pricing 1: 1=0.1, 10=0.025, 25=0.018, 50=0.0136, 100=0.01, 250=0.00764, 500=0.00612, 1000=0.00451, 5000=0.00323 (USD); Packaging: Digi-Reel®; Part Status: Active; Resistance (Ohms): 1M; Tolerance: ±1%; Composition: Thick Film; Features: Automotive AEC-Q200; Operating Temperature: -55°C ~ 155°C; Package / Case: 0402 (1005 Metric); Supplier Device Package: 0402; Size / Dimension: 0.039" L x 0.020" W (1.00mm x 0.50mm); Height - Seated (Max): 0.016" (0.40mm); Number of Terminations: 2; Failure Rate: -; ComponentLink1URL: https://industrial.panasonic.com/cdbs/www-data/pdf/RDA0000/AOA0000C283.pdf; ComponentLink1Description: https://industrial.panasonic.com/cdbs/www-data/pdf/RDA0000/AOA0000C283.pdf; Supplier Part Number 1: P1.00MLDKR-ND; Value: 1 M
U8 = BHI360: Programmable smart sensor combining accelerometer, gyroscope and fusion software; Manufacturer: Bosch Tools; Supplier: Digikey; Supplier Part Number: 828-BHI360DKR-ND; Manufacturer Part Number: BHI360; RoHS: No; Category: Uncategorized; Stock: 17060; Pricing: 1=6.54, 10=5.232, 25=4.8396, 100=4.1854, 500=3.92384, 1000=3.66226 (USD); Supplier 1: Digikey; Supplier Part Number 1: 828-BHI360DKR-ND; Supplier 2: Mouser; Supplier Part Number 2: 262-BHI360